# Altium schematic sheet CAN.SchDoc
size A3
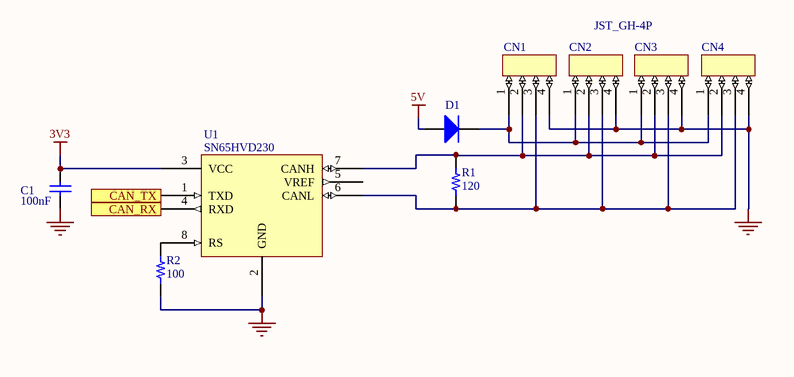
[diagram p0: CAN.SchDoc]

## Parts
C1  value 100nF  [0402]  (hidden comment: Cap)
CN1  JST_GH-4P  [JST_GH-4P]
CN2  JST_GH-4P  [JST_GH-4P]  (value not drawn)
CN3  JST_GH-4P  [JST_GH-4P]  (value not drawn)
CN4  JST_GH-4P  [JST_GH-4P]  (value not drawn)
D1  SS12F  [SMAF_DIODE]  (value not drawn)
R1  120  [2010_SMD_Resistor]
R2  100  [0805 - duplicate]
U1  SN65HVD230  [SOIC8-TI_CAN]

## Ports
CAN_RX, CAN_TX

## Nets
3V3: C1.2 U1.3(VCC)
5V: D1.1(A)
GND: C1.1 CN1.4 CN2.4 CN3.4 CN4.4 R2.1 U1.2(GND)
CAN_RX: U1.4(RXD) ; port CAN_RX
CAN_TX: U1.1(TXD) ; port CAN_TX
NetCN1_1: CN1.1 CN2.1 CN3.1 CN4.1 D1.2(K)
NetCN1_2: CN1.2 CN2.2 CN3.2 CN4.2 R1.2 U1.7(CANH)
NetCN1_3: CN1.3 CN2.3 CN3.3 CN4.3 R1.1 U1.6(CANL)
NetR2_2: R2.2 U1.8(RS)

Not connected (* = marked no-connect by the designer): U1 5(VREF)

## Library data of the parts
R1 R2 = Resistor
U1 = SN65HVD230: CAN Transceiver
C1 = Cap: Published: 8-Jun-2000; LatestRevisionDate: 17-Jul-2002; LatestRevisionNote: Re-released for DXP Platform.; PackageReference: RAD-0.3; Publisher: Altium Limited; PackageDescription: Radial Cap, Thru-Hole; 2 Leads; 0.3 in Pin Spacing